# EAGLE schematic LifeBoardV1.2_stm (EAGLE 9.6.2)
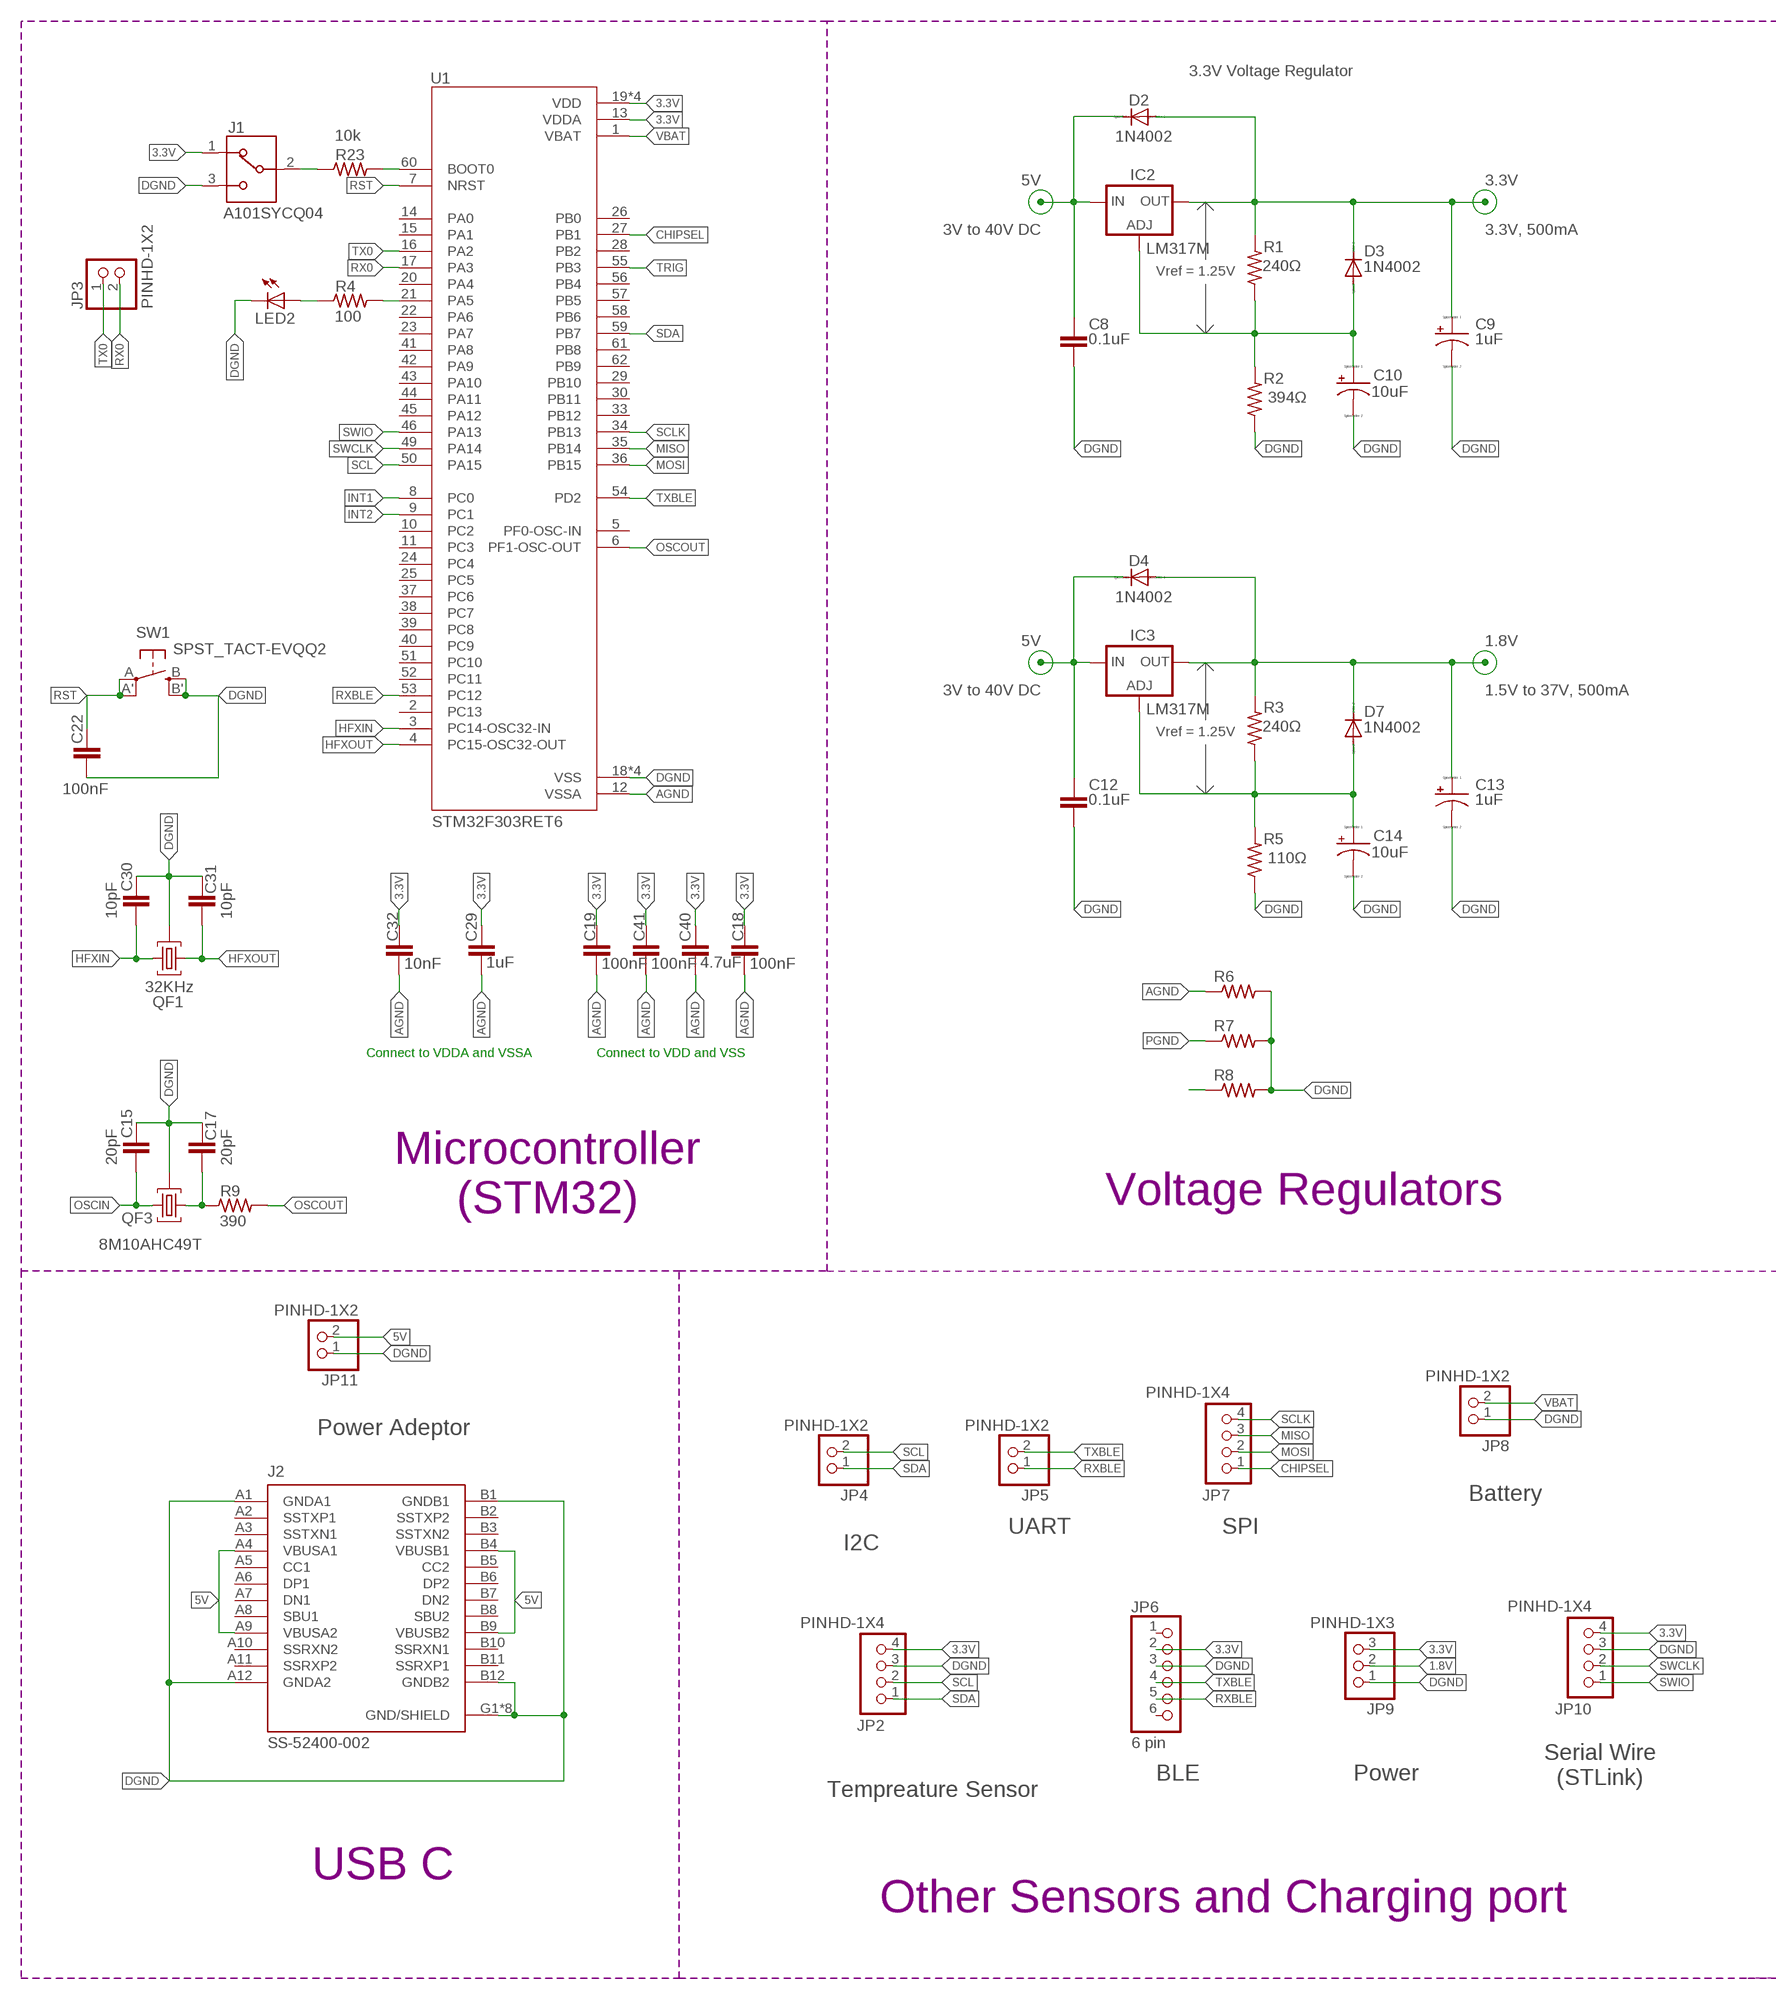
[diagram p0: schematic, sheet 1, part 1 of 2]
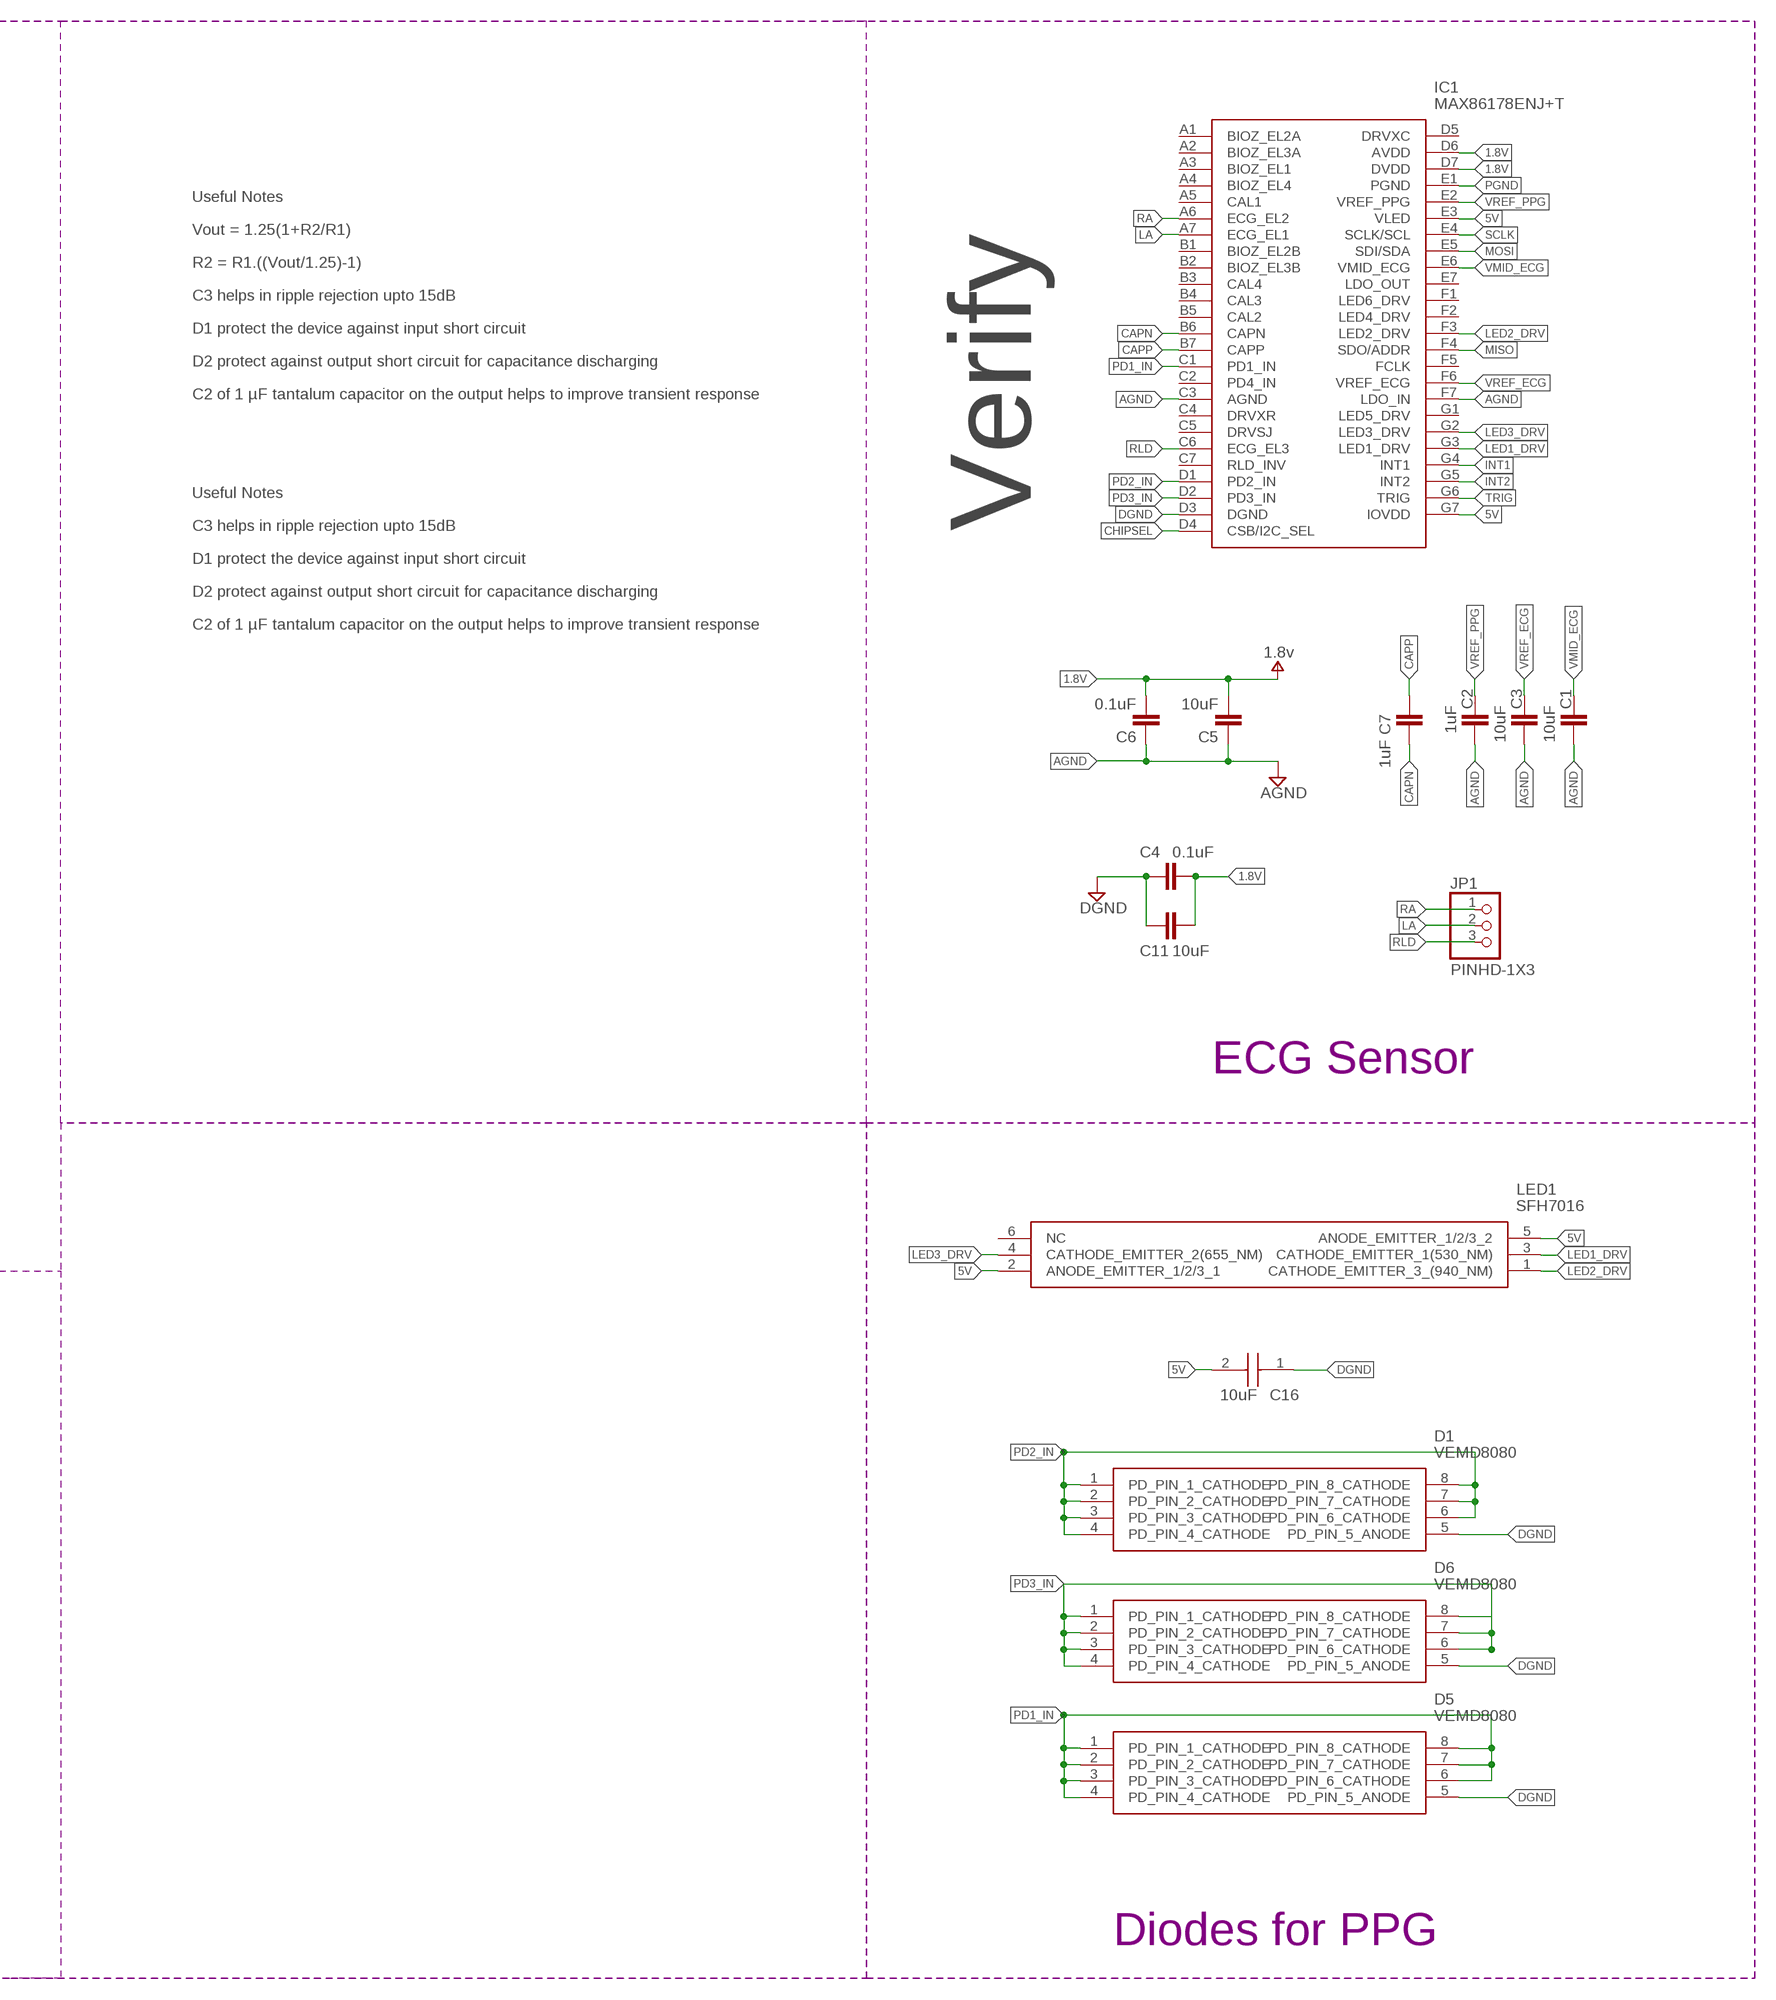
[diagram p1: schematic, sheet 1, part 2 of 2]

## Parts
C1  10uF  C-EUC0805  [C0805]
C2  1uF  C-EUC0805  [C0805]
C3  10uF  C-EUC0805  [C0805]
C4  0.1uF  C-EUC0805  [C0805]
C5  10uF  C-EUC0805  [C0805]
C6  0.1uF  C-EUC0805  [C0805]
C7  1uF  C-EUC0805  [C0805]
C8  0.1uF  C-EU075-052X106  [C075-052X106]
C9  1uF  CPOL-US085CS-1AR  [085CS_1AR]
C10  10uF  CPOL-US085CS-1AR  [085CS_1AR]
C11  10uF  C-EUC0805  [C0805]
C12  0.1uF  C-EU075-052X106  [C075-052X106]
C13  1uF  CPOL-US085CS-1AR  [085CS_1AR]
C14  10uF  CPOL-US085CS-1AR  [085CS_1AR]
C15  20pF  C-EUC0805  [C0805]
C16  10uF  GRM188R61E106MA73L  [CAPC1608X90N]
C17  20pF  C-EUC0805  [C0805]
C18  100nF  C-EUC0805  [C0805]
C19  100nF  C-EUC0805  [C0805]
C22  100nF  C-EUC0805  [C0805]
C29  1uF  C-EUC0805  [C0805]
C30  10pF  C-EUC0805  [C0805]
C31  10pF  C-EUC0805  [C0805]
C32  10nF  C-EUC0805  [C0805]
C40  4.7uF  C-EUC0805  [C0805]
C41  100nF  C-EUC0805  [C0805]
D1  VEMD8080  [VEMD8080]
D2  1N4002  1N4004  [DO41-10]
D3  1N4002  1N4004  [DO41-10]
D4  1N4002  1N4004  [DO41-10]
D5  VEMD8080  [VEMD8080]
D6  VEMD8080  [VEMD8080]
D7  1N4002  1N4004  [DO41-10]
IC1  MAX86178ENJ+T  [BGA49C35P7X7_277X257X50]
IC2  LM317MBSTT3  [SOT223]
IC3  LM317MBSTT3  [SOT223]
J1  A101SYCQ04  [TE_A101SYCQ04]
J2  SS-52400-002  [BELFUSE_SS-52400-002]
JP1  PINHD-1X3  [1X03]
JP2  PINHD-1X4  [1X04]
JP3  PINHD-1X2  [1X02]
JP4  PINHD-1X2  [1X02]
JP5  PINHD-1X2  [1X02]
JP6  6 pin  PINHD-1X6  [1X06]
JP7  PINHD-1X4  [1X04]
JP8  PINHD-1X2  [1X02]
JP9  PINHD-1X3  [1X03]
JP10  PINHD-1X4  [1X04]
JP11  PINHD-1X2  [1X02]
LED1  SFH7016  [SFH7016]
LED2  LEDCHIP-LED0805  [CHIP-LED0805]
QF1  32KHz  8M10AHC49T  [HC49U]
QF3  8M10AHC49T  [HC49U]
R1  240Ω  R-US_M0805  [M0805]
R2  394Ω  R-US_M0805  [M0805]
R3  240Ω  R-US_M0805  [M0805]
R4  100  R-US_M1206  [M1206]
R5  110Ω  R-US_M0805  [M0805]
R6  R-US_M0805  [M0805]
R7  R-US_M0805  [M0805]
R8  R-US_M0805  [M0805]
R9  390  R-US_M1206  [M1206]
R23  10k  R-US_M1206  [M1206]
SW1  SPST_TACT-EVQQ2  [EVQ-Q2]
U1  STM32F303RET6  [QFP50P1200X1200X160-64N]

## Nets
1.8V: C4.2 C5.2 C6.2 C11.2 C13.+ D4.A D7.C IC1.D6(AVDD) IC1.D7(DVDD) IC3.4(OUT) JP9.2 R3.2 ; supply symbol labelled 1.8v
3.3V: C9.+ C18.1 C19.1 C29.1 C32.1 C40.1 C41.1 D2.A D3.C IC2.4(OUT) J1.1 JP2.4 JP6.2 JP9.3 JP10.4 R1.2 U1.13(VDDA) U1.19(VDD) U1.32(VDD) U1.48(VDD) U1.64(VDD)
5V: C8.1 C12.1 C16.2 D2.C D4.C IC1.E3(VLED) IC1.G7(IOVDD) IC2.3(IN) IC3.3(IN) J2.A4(VBUSA1) J2.A9(VBUSA2) J2.B4(VBUSB1) J2.B9(VBUSB2) JP11.2 LED1.2(ANODE_EMITTER_1/2/3_1) LED1.5(ANODE_EMITTER_1/2/3_2)
AGND: C1.1 C2.1 C3.1 C5.1 C6.1 C18.2 C19.2 C29.2 C32.2 C40.2 C41.2 IC1.C3(AGND) IC1.F7(LDO_IN) R6.1 U1.12(VSSA)
CAPN: C7.2 IC1.B6(CAPN)
CAPP: C7.1 IC1.B7(CAPP)
CHIPSEL: IC1.D4(CSB/I2C_SEL) JP7.1 U1.27(PB1)
DGND: C4.1 C8.2 C9.- C10.- C11.1 C12.2 C13.- C14.- C15.1 C16.1 C17.1 C22.2 C30.1 C31.1 D1.5(PD_PIN_5_ANODE) D5.5(PD_PIN_5_ANODE) D6.5(PD_PIN_5_ANODE) IC1.D3(DGND) J1.3 J2.A1(GNDA1) J2.A12(GNDA2) J2.B1(GNDB1) J2.B12(GNDB2) J2.G1(GND/SHIELD) J2.G2(GND/SHIELD) J2.G3(GND/SHIELD) J2.G4(GND/SHIELD) J2.S1(GND/SHIELD) J2.S2(GND/SHIELD) J2.S3(GND/SHIELD) J2.S4(GND/SHIELD) JP2.3 JP6.3 JP8.1 JP9.1 JP10.3 JP11.1 LED2.C QF1.2 QF3.2 R2.1 R5.1 R6.2 R7.2 R8.2 SW1.B'(S1) SW1.B(S) U1.18(VSS) U1.31(VSS) U1.47(VSS) U1.63(VSS)
HFXIN: C30.2 QF1.3 U1.3(PC14-OSC32-IN)
HFXOUT: C31.2 QF1.1 U1.4(PC15-OSC32-OUT)
INT1: IC1.G4(INT1) U1.8(PC0)
INT2: IC1.G5(INT2) U1.9(PC1)
LA: IC1.A7(ECG_EL1) JP1.2
LED1_DRV: IC1.G3(LED1_DRV) LED1.3(CATHODE_EMITTER_1(530_NM))
LED2_DRV: IC1.F3(LED2_DRV) LED1.1(CATHODE_EMITTER_3_(940_NM))
LED3_DRV: IC1.G2(LED3_DRV) LED1.4(CATHODE_EMITTER_2(655_NM))
MISO: IC1.F4(SDO/ADDR) JP7.3 U1.35(PB14)
MOSI: IC1.E5(SDI/SDA) JP7.2 U1.36(PB15)
N$1: C10.+ D3.A IC2.1(ADJ) R1.1 R2.2
N$2: C14.+ D7.A IC3.1(ADJ) R3.1 R5.2
N$3: LED2.A R4.1
N$4: R23.2 U1.60(BOOT0)
N$5: J1.2 R23.1
N$6: R4.2 U1.21(PA5)
N$7: C17.2 QF3.1 R9.1
N$10: R8.1
OSCIN: C15.2 QF3.3
OSCOUT: R9.2 U1.6(PF1-OSC-OUT)
PD1_IN: D5.1(PD_PIN_1_CATHODE) D5.2(PD_PIN_2_CATHODE) D5.3(PD_PIN_3_CATHODE) D5.4(PD_PIN_4_CATHODE) D5.6(PD_PIN_6_CATHODE) D5.7(PD_PIN_7_CATHODE) D5.8(PD_PIN_8_CATHODE) IC1.C1(PD1_IN)
PD2_IN: D1.1(PD_PIN_1_CATHODE) D1.2(PD_PIN_2_CATHODE) D1.3(PD_PIN_3_CATHODE) D1.4(PD_PIN_4_CATHODE) D1.6(PD_PIN_6_CATHODE) D1.7(PD_PIN_7_CATHODE) D1.8(PD_PIN_8_CATHODE) IC1.D1(PD2_IN)
PD3_IN: D6.1(PD_PIN_1_CATHODE) D6.2(PD_PIN_2_CATHODE) D6.3(PD_PIN_3_CATHODE) D6.4(PD_PIN_4_CATHODE) D6.6(PD_PIN_6_CATHODE) D6.7(PD_PIN_7_CATHODE) D6.8(PD_PIN_8_CATHODE) IC1.D2(PD3_IN)
PGND: IC1.E1(PGND) R7.1
RA: IC1.A6(ECG_EL2) JP1.1
RLD: IC1.C6(ECG_EL3) JP1.3
RST: C22.1 SW1.A'(P1) SW1.A(P) U1.7(NRST)
RX0: JP3.2 U1.17(PA3)
RXBLE: JP5.1 JP6.5 U1.53(PC12)
SCL: JP2.2 JP4.2 U1.50(PA15)
SCLK: IC1.E4(SCLK/SCL) JP7.4 U1.34(PB13)
SDA: JP2.1 JP4.1 U1.59(PB7)
SWCLK: JP10.2 U1.49(PA14)
SWIO: JP10.1 U1.46(PA13)
TRIG: IC1.G6(TRIG) U1.55(PB3)
TX0: JP3.1 U1.16(PA2)
TXBLE: JP5.2 JP6.4 U1.54(PD2)
VBAT: JP8.2 U1.1(VBAT)
VMID_ECG: C1.2 IC1.E6(VMID_ECG)
VREF_ECG: C3.2 IC1.F6(VREF_ECG)
VREF_PPG: C2.2 IC1.E2(VREF_PPG)
Unconnected: IC1.A1(BIOZ_EL2A) IC1.A2(BIOZ_EL3A) IC1.A3(BIOZ_EL1) IC1.A4(BIOZ_EL4) IC1.A5(CAL1) IC1.B1(BIOZ_EL2B) IC1.B2(BIOZ_EL3B) IC1.B3(CAL4) IC1.B4(CAL3) IC1.B5(CAL2) IC1.C2(PD4_IN) IC1.C4(DRVXR) IC1.C5(DRVSJ) IC1.C7(RLD_INV) IC1.D5(DRVXC) IC1.E7(LDO_OUT) IC1.F1(LED6_DRV) IC1.F2(LED4_DRV) IC1.F5(FCLK) IC1.G1(LED5_DRV) J2.A2(SSTXP1) J2.A3(SSTXN1) J2.A5(CC1) J2.A6(DP1) J2.A7(DN1) J2.A8(SBU1) J2.A10(SSRXN2) J2.A11(SSRXP2) J2.B2(SSTXP2) J2.B3(SSTXN2) J2.B5(CC2) J2.B6(DP2) J2.B7(DN2) J2.B8(SBU2) J2.B10(SSRXN1) J2.B11(SSRXP1) JP6.1 JP6.6 LED1.6(NC) U1.2(PC13) U1.5(PF0-OSC-IN) U1.10(PC2) U1.11(PC3) U1.14(PA0) U1.15(PA1) U1.20(PA4) U1.22(PA6) U1.23(PA7) U1.24(PC4) U1.25(PC5) U1.26(PB0) U1.28(PB2) U1.29(PB10) U1.30(PB11) U1.33(PB12) U1.37(PC6) U1.38(PC7) U1.39(PC8) U1.40(PC9) U1.41(PA8) U1.42(PA9) U1.43(PA10) U1.44(PA11) U1.45(PA12) U1.51(PC10) U1.52(PC11) U1.56(PB4) U1.57(PB5) U1.58(PB6) U1.61(PB8) U1.62(PB9)

## Notes on the sheet
- 3.3V Voltage Regulator
- Useful Notes
- 3V to 40V DC | 3.3V, 500mA | Vout = 1.25(1+R2/R1)
- R2 = R1.((Vout/1.25)-1)
- Vref = 1.25V
- C3 helps in ripple rejection upto 15dB
- D1 protect the device against input short circuit
- D2 protect against output short circuit for capacitance discharging
- C2 of 1 µF tantalum capacitor on the output helps to improve transient response
- Useful Notes
- C3 helps in ripple rejection upto 15dB | Verify
- D1 protect the device against input short circuit
- D2 protect against output short circuit for capacitance discharging
- C2 of 1 µF tantalum capacitor on the output helps to improve transient response
- 3V to 40V DC | 1.5V to 37V, 500mA
- Vref = 1.25V
- Connect to VDDA and VSSA | Connect to VDD and VSS
- ECG Sensor
- Microcontroller
  (STM32)
- Voltage Regulators
- Power Adeptor
- Battery
- UART | SPI
- I2C
- Serial Wire
  (STLink)
- BLE | Power
- Tempreature Sensor
- USB C
- Other Sensors and Charging port
- Diodes for PPG

## Library data of the parts
C1-C8 C11 C12 C15 C17-C19 C22 C29-C32 C40 C41 = rcl:C-EU: CAPACITOR, European symbol
C9 C10 C13 C14 = resistor:CPOL-US: POLARIZED CAPACITOR, American symbol
C16 = GRM188R61E106MA73L:GRM188R61E106MA73L: Murata 0603 GRM 10uF Ceramic Multilayer Capacitor, 25 V dc, +85C, X5R Dielectric, +/-20% SMD Source: Datasheet <https://datasheet.datasheetarchive.com/originals/distributors/DKDS42/DSANUWW0047682.pdf>; ARROW_PART_NUMBER: GRM188R61E106MA73L; ARROW_PRICE-STOCK: https://www.arrow.com/en/products/grm188r61e106ma73l/murata-manufacturing; DESCRIPTION: Murata 0603 GRM 10uF Ceramic Multilayer Capacitor, 25 V dc, +85C, X5R Dielectric, +/-20% SMD; HEIGHT: 0.9mm; MANUFACTURER_NAME: Murata Electronics; MANUFACTURER_PART_NUMBER: GRM188R61E106MA73L; MOUSER_PART_NUMBER: 81-GRM188R61E106MA3L; MOUSER_PRICE-STOCK: https://www.mouser.co.uk/ProductDetail/Murata-Electronics/GRM188R61E106MA73L?qs=O5cugoO6nwfz85kEL7somA%3D%3D
D1 D5 D6 = VEMD8080:VEMD8080: Photodiodes Pin Photodiode 20V 350-1100nm; 28uA Source: Datasheet <https://www.vishay.com/docs/84565/vemd8080.pdf>; ARROW_PART_NUMBER: VEMD8080; ARROW_PRICE-STOCK: https://www.arrow.com/en/products/vemd8080/vishay?region=nac; DESCRIPTION: Photodiodes Pin Photodiode 20V 350-1100nm; 28uA; HEIGHT: 0.53mm; MANUFACTURER_NAME: Vishay; MANUFACTURER_PART_NUMBER: VEMD8080; MOUSER_PART_NUMBER: 78-VEMD8080; MOUSER_PRICE-STOCK: https://www.mouser.co.uk/ProductDetail/Vishay-Semiconductors/VEMD8080?qs=F5EMLAvA7IBCchs2bw9l%2Fw%3D%3D
D2-D4 D7 = diode:1N4004: DIODE general purpose rectifier, 1 A
IC1 = MAX86178ENJ+T:MAX86178ENJ+T: Ultra-Low-Power, Clinical-Grade Vital-Sign AFE Source: Datasheet <https://g.componentsearchengine.com/Datasheets/0/15123196.pdf>; DESCRIPTION: Ultra-Low-Power, Clinical-Grade Vital-Sign AFE; HEIGHT: 0.5mm; MANUFACTURER_NAME: Maxim Integrated; MANUFACTURER_PART_NUMBER: MAX86178ENJ+T; MOUSER_PART_NUMBER: 700-MAX86178ENJ+T; MOUSER_PRICE-STOCK: https://www.mouser.co.uk/ProductDetail/Maxim-Integrated/MAX86178ENJ%2bT?qs=A6eO%252BMLsxmSS411w8Lj65w%3D%3D
IC2 IC3 = v-reg:LM317?*: 500 mA Adjustable Output Positive Voltage Regulator Source: http://www.onsemi.co.jp .. LM317M-D.PDF; PARTNUMBER: LM317M
J1 = A101SYCQ04:A101SYCQ04: Switch Toggle ON None ON SPDT Long Baton Lever PC Pins 5A 250VAC 28VDC PC Mount with Threads Bulk; AVAILABILITY: Unavailable; COMMENT: 4-1825136-5; DESCRIPTION: Toggle Switch SPDT Panel Mount; MF: TE Connectivity; MP: A101SYCQ04; PACKAGE: SOIC-8 TE Connectivity; PRICE: None
J2 = SS-52400-002:SS-52400-002: USB Type-C Connector | 1 Port | Right Angle Receptacle | Shielded | 0.039"[1.00mm] Check availability <https://pricing.snapeda.com/parts/SS-52400-002/Stewart%20Connector/view-part?ref=eda>; AVAILABILITY: In Stock; DESCRIPTION: USB Type-C Connector | 1 Port | Right Angle Receptacle | Shielded | 0.039[1.00mm]; MF: Stewart Connector; MP: SS-52400-002; PACKAGE: None; PRICE: None; PURCHASE-URL: https://pricing.snapeda.com/search/part/SS-52400-002/?ref=eda
JP1 JP9 = Connector:PINHD-1X3: PIN HEADER; CATEGORY: CONNECTOR; SUB-CATEGORY: PIN-HEADER
JP2 JP7 JP10 = Connector:PINHD-1X4: PIN HEADER; CATEGORY: CONNECTOR; SUB-CATEGORY: PIN-HEADER
JP3-JP5 JP8 JP11 = Connector:PINHD-1X2: PIN HEADER; CATEGORY: CONNECTOR; SUB-CATEGORY: PIN-HEADER
JP6 = pinhead:PINHD-1X6: PIN HEADER
LED1 = SFH7016:SFH7016: Green (530 nm), Red (655 nm) and Infrared (940 nm) Emitter Source: Datasheet <https://www.osram.com/ecat/Multi CHIPLED SFH 7016/com/en/class_pim_web_catalog_103489/prd_pim_device_6572351/#62a1fdff42f13778e2055fdc87c50fcb>; DESCRIPTION: Green (530 nm), Red (655 nm) and Infrared (940 nm) Emitter; HEIGHT: 0.7mm; MANUFACTURER_NAME: OSRAM; MANUFACTURER_PART_NUMBER: SFH7016
LED2 = adafruit:LED: LED OSRAM: - CHIPLED LG R971, LG N971, LY N971, LG Q971, LY Q971, LO R971, LY R971 LH N974, LH R974 LS Q976, LO Q976, LY Q976 LO Q996 - Hyper CHIPLED LW Q18S LB Q993, LB Q99A, LB R99A - SideLED LS A670, LO A670, LY A670, LG A670, LP A670 LB A673, LV A673, LT A673, LW A673 LH A674 LY A675 LS A676, LA A676, LO A676, LY A676, LW A676 LS A679, LY A679, LG A679 - Hyper Micro SIDELED® LS Y876, LA Y876, LO Y876, LY Y876 LT Y87S - SmartLED LW L88C, LW L88S LB L89C, LB L89S, LG L890 LS L89K, LO L89K, LY L89K LS L896, LA L896, LO L896, LY L896 - TOPLED LS T670, LO T670, LY T670, LG T670, LP T670 LSG T670, LSP T670, LSY T670, LOP T670, LYG T670 LG T671, LOG T671, LSG T671 LB T673, LV T673, LT T673, LW T673 LH T674 LS T676, LA T676, LO T676, LY T676, LB T676, LH T676, LSB T676, LW T676 LB T67C, LV T67C, LT T67C, LS T67K, LO T67K, LY T67K, LW E67C LS E67B, LA E67B, LO E67B, LY E67B, LB E67C, LV E67C, LT E67C LW T67C LS T679, LY T679, LG T679 LS T770, LO T770, LY T770, LG T770, LP T770 LB T773, LV T773, LT T773, LW T773 LH T774 LS E675, LA E675, LY E675, LS T675 LS T776, LA T776, LO T776, LY T776, LB T776 LHGB T686 LT T68C, LB T68C - Hyper Mini TOPLED® LB M676 - Mini TOPLED Santana® LG M470 LS M47K, LO M47K, LY M47K Source: http://www.osram.convergy.de/
QF1 QF3 = crystal:8M10AHC49T: Monolithic Crystal Filters Source: www.vanlong.com; OC_FARNELL: unknown; OC_NEWARK: unknown
R1-R3 R5 = resistor:R-US_: RESISTOR, American symbol
R4 R6-R9 R23 = adafruit:R-US_: RESISTOR, American symbol
SW1 = adafruit:SPST_TACT: SMT 6mm switch, EVQQ2 series http://www.ladyada.net/library/eagle
U1 = STM32F303RET6:STM32F303RET6: MCU 32-Bit STM32 ARM Cortex M4 RISC 512KB Flash 2.5V/3.3V 64-Pin LQFP Tray Check availability <https://pricing.snapeda.com/parts/STM32F303RET6/STMicroelectronics/view-part?ref=eda>; AVAILABILITY: In Stock; DESCRIPTION: ARM® Cortex®-M4 STM32F3 Microcontroller IC 32-Bit Single-Core 72MHz 512KB (512K x 8) FLASH 64-LQFP (10x10); MF: STMicroelectronics; MP: STM32F303RET6; PACKAGE: LQFP-64 STMicroelectronics; PRICE: None; PURCHASE-URL: https://pricing.snapeda.com/search/part/STM32F303RET6/?ref=eda